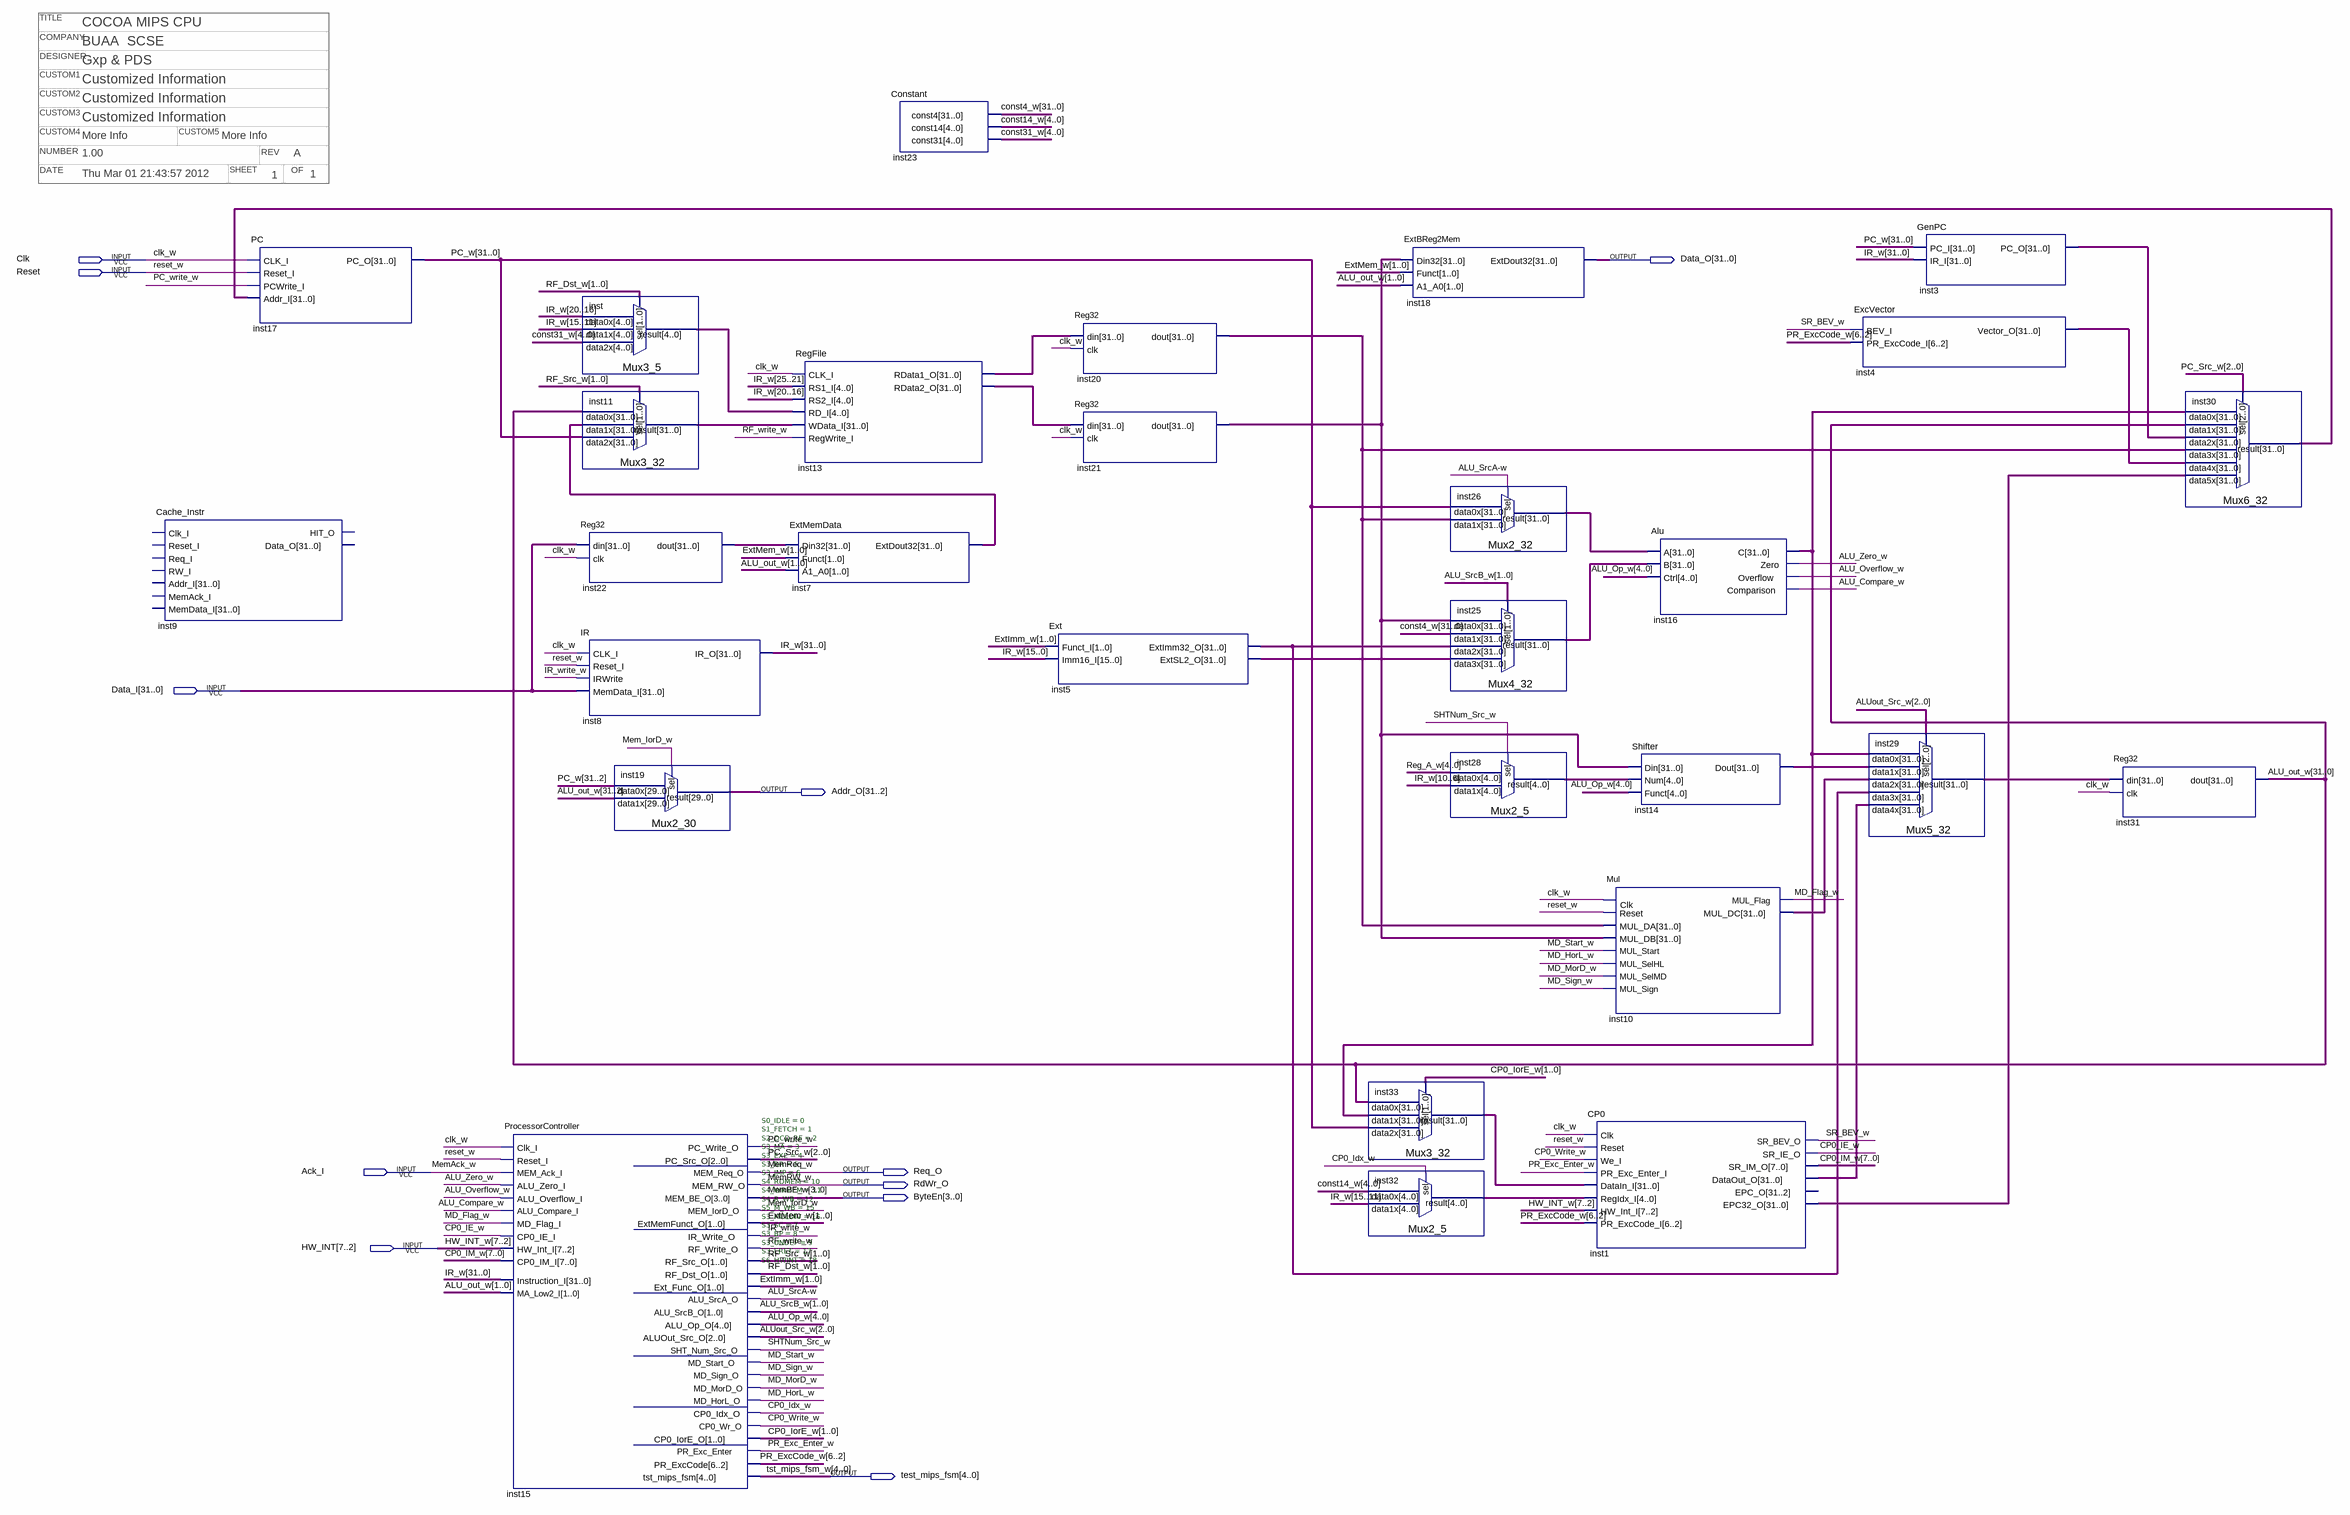
[diagram p0: schematic sheet]
// Quartus schematic MIPS_CPU.bdf as structural Verilog: 29 symbols, 11 pins
// Title block: COMPANY: BUAA  SCSE; CUSTOM1: Customized Information; CUSTOM2: Customized Information; CUSTOM3: Customized Information; CUSTOM4: More Info; CUSTOM5: More Info; DATE: Thu Mar 01 21:43:57 2012; DESIGNER: Gxp & PDS; NUMBER: 1.00; OF: 1; REV: A; SHEET: 1; TITLE: COCOA MIPS CPU
module MIPS_CPU (
  input  Clk,
  input  Reset,
  input  [31:0] Data_I,
  input  Ack_I,
  input  [7:2] HW_INT,
  output [31:0] Data_O,
  output [31:2] Addr_O,
  output Req_O,
  output RdWr_O,
  output [3:0] ByteEn,
  output [4:0] test_mips_fsm
);

  wire ALU_Compare_w, ALU_Overflow_w, \ALU_SrcA-w , ALU_Zero_w, CP0_Idx_w, CP0_IE_w, CP0_Write_w, IR_write_w,
       MD_Flag_w, MD_HorL_w, MD_MorD_w, MD_Sign_w, MD_Start_w, Mem_IorD_w, PC_write_w, PR_Exc_Enter_w,
       RF_write_w, SHTNum_Src_w, SR_BEV_w;
  wire [1:0] ALU_SrcB_w, CP0_IorE_w, ExtImm_w, ExtMem_w, RF_Dst_w, RF_Src_w;
  wire [2:0] ALUout_Src_w, PC_Src_w;
  wire [4:0] ALU_Op_w, const14_w, const31_w, inst28_result, inst32_result, inst_result, Reg_A_w;
  wire [6:2] PR_ExcCode_w;
  wire [7:0] CP0_IM_w;
  wire [31:0] ALU_out_w, const4_w, inst1_dataout_o, inst1_epc32_o, inst3_pc_o, inst4_vector_o,
       inst5_extimm32_o, inst5_extsl2_o, inst7_extdout32, inst10_mul_dc, inst11_result, inst13_rdata1_o,
       inst13_rdata2_o, inst14_dout, inst16_c, inst20_dout, inst21_dout, inst22_dout, inst25_result,
       inst26_result, inst29_result, inst30_result, inst33_result, IR_w, PC_w;

  Cache_Instr inst9 ();  // open: Clk_I, Reset_I, Req_I, RW_I, Addr_I, MemAck_I, MemData_I, HIT_O, Data_O
  PC inst17 (.CLK_I(Clk), .Reset_I(Reset), .Addr_I(inst30_result), .PCWrite_I(PC_write_w), .PC_O(PC_w));
  ProcessorController #(.S0_IDLE(0), .S1_FETCH(1), .S2_DCD_RF(2), .S3_MA(3), .S3_EXE(4), .S3_BR(5), .S3_JMP(6), .S4_RDMEM(10), .S4_WRMEM(11), .S4_R_WB(12), .S5_M_WB(15), .S3_MULDIV(16), .S3_SC(7), .S3_BP(8), .S3_UNDEF(9), .S3_ERET(17), .S6_HWINT(18)) inst15 (
    .MA_Low2_I(ALU_out_w[1:0]), .Instruction_I(IR_w), .MEM_Ack_I(Ack_I), .ALU_Zero_I(ALU_Zero_w),
    .ALU_Overflow_I(ALU_Overflow_w), .ALU_Compare_I(ALU_Compare_w), .MD_Flag_I(MD_Flag_w),
    .CP0_IM_I(CP0_IM_w), .CP0_IE_I(CP0_IE_w), .HW_Int_I(HW_INT), .Clk_I(Clk), .Reset_I(Reset),
    .PC_Write_O(PC_write_w), .PC_Src_O(PC_Src_w), .MEM_Req_O(Req_O), .MEM_RW_O(RdWr_O), .MEM_BE_O(ByteEn),
    .MEM_IorD_O(Mem_IorD_w), .IR_Write_O(IR_write_w), .ExtMemFunct_O(ExtMem_w), .RF_Write_O(RF_write_w),
    .RF_Dst_O(RF_Dst_w), .RF_Src_O(RF_Src_w), .Ext_Func_O(ExtImm_w), .ALU_SrcA_O(\ALU_SrcA-w ),
    .ALU_SrcB_O(ALU_SrcB_w), .ALU_Op_O(ALU_Op_w), .ALUOut_Src_O(ALUout_Src_w), .SHT_Num_Src_O(SHTNum_Src_w),
    .MD_MorD_O(MD_MorD_w), .MD_Sign_O(MD_Sign_w), .MD_Start_O(MD_Start_w), .MD_HorL_O(MD_HorL_w),
    .CP0_IorE_O(CP0_IorE_w), .CP0_Idx_O(CP0_Idx_w), .CP0_Wr_O(CP0_Write_w), .PR_Exc_Enter(PR_Exc_Enter_w),
    .PR_ExcCode(PR_ExcCode_w), .tst_mips_fsm(test_mips_fsm));
  Mux3_5 inst (.data2x(const31_w), .data1x(IR_w[15:11]), .data0x(IR_w[20:16]), .sel(RF_Dst_w), .result(inst_result));
  Mux3_32 inst11 (.data2x(PC_w), .data1x(inst7_extdout32), .data0x(ALU_out_w), .sel(RF_Src_w), .result(inst11_result));
  Reg32 inst22 (.din(Data_I), .clk(Clk), .dout(inst22_dout));
  IR inst8 (.CLK_I(Clk), .Reset_I(Reset), .MemData_I(Data_I), .IRWrite(IR_write_w), .IR_O(IR_w));
  Mux2_30 inst19 (.data1x(ALU_out_w[31:2]), .data0x(PC_w[31:2]), .sel(Mem_IorD_w), .result(Addr_O));
  RegFile inst13 (
    .CLK_I(Clk), .RS1_I(IR_w[25:21]), .RS2_I(IR_w[20:16]), .RD_I(inst_result), .RegWrite_I(RF_write_w),
    .WData_I(inst11_result), .RData1_O(inst13_rdata1_o), .RData2_O(inst13_rdata2_o));
  ExtMemData inst7 (.Din32(inst22_dout), .Funct(ExtMem_w), .A1_A0(ALU_out_w[1:0]), .ExtDout32(inst7_extdout32));
  Constant inst23 (.const4(const4_w), .const14(const14_w), .const31(const31_w));
  Reg32 inst20 (.din(inst13_rdata1_o), .clk(Clk), .dout(inst20_dout));
  Reg32 inst21 (.din(inst13_rdata2_o), .clk(Clk), .dout(inst21_dout));
  Ext inst5 (.Funct_I(ExtImm_w), .Imm16_I(IR_w[15:0]), .ExtImm32_O(inst5_extimm32_o), .ExtSL2_O(inst5_extsl2_o));
  Mux3_32 inst33 (.data2x(PC_w), .data1x(inst16_c), .data0x(ALU_out_w), .sel(CP0_IorE_w), .result(inst33_result));
  Mux2_5 inst32 (.data1x(IR_w[15:11]), .data0x(const14_w), .sel(CP0_Idx_w), .result(inst32_result));
  ExtBReg2Mem inst18 (.Din32(inst21_dout), .Funct(ExtMem_w), .A1_A0(ALU_out_w[1:0]), .ExtDout32(Data_O));
  Mux2_32 inst26 (.data1x(inst20_dout), .data0x(PC_w), .sel(\ALU_SrcA-w ), .result(inst26_result));
  Mux4_32 inst25 (
    .data3x(inst5_extsl2_o), .data2x(inst5_extimm32_o), .data1x(const4_w), .data0x(inst21_dout),
    .sel(ALU_SrcB_w), .result(inst25_result));
  Mux2_5 inst28 (.data1x(IR_w[10:6]), .data0x(Reg_A_w), .sel(SHTNum_Src_w), .result(inst28_result));
  CP0 inst1 (
    .RegIdx_I(inst32_result), .DataIn_I(inst33_result), .We_I(CP0_Write_w), .PR_Exc_Enter_I(PR_Exc_Enter_w),
    .PR_ExcCode_I(PR_ExcCode_w), .HW_Int_I(HW_INT), .Clk(Clk), .Reset(Reset), .DataOut_O(inst1_dataout_o),
    .SR_BEV_O(SR_BEV_w), .SR_IM_O(CP0_IM_w), .SR_IE_O(CP0_IE_w), .EPC32_O(inst1_epc32_o));  // open: EPC_O
  Shifter inst14 (.Din(inst21_dout), .Num(inst28_result), .Funct(ALU_Op_w), .Dout(inst14_dout));
  Mul inst10 (
    .Reset(Reset), .MUL_DA(inst20_dout), .MUL_DB(inst21_dout), .Clk(Clk), .MUL_SelHL(MD_HorL_w),
    .MUL_Start(MD_Start_w), .MUL_SelMD(MD_MorD_w), .MUL_Sign(MD_Sign_w), .MUL_Flag(MD_Flag_w),
    .MUL_DC(inst10_mul_dc));
  Alu inst16 (
    .A(inst26_result), .B(inst25_result), .Ctrl(ALU_Op_w), .C(inst16_c), .Zero(ALU_Zero_w),
    .Overflow(ALU_Overflow_w), .Comparison(ALU_Compare_w));
  ExcVector inst4 (.BEV_I(SR_BEV_w), .PR_ExcCode_I(PR_ExcCode_w), .Vector_O(inst4_vector_o));
  Mux5_32 inst29 (
    .data4x(inst1_dataout_o), .data3x(inst5_extimm32_o), .data2x(inst10_mul_dc), .data1x(inst14_dout),
    .data0x(inst16_c), .sel(ALUout_Src_w), .result(inst29_result));
  GenPC inst3 (.PC_I(PC_w), .IR_I(IR_w), .PC_O(inst3_pc_o));
  Reg32 inst31 (.din(inst29_result), .clk(Clk), .dout(ALU_out_w));
  Mux6_32 inst30 (
    .data5x(inst1_epc32_o), .data4x(inst4_vector_o), .data3x(inst20_dout), .data2x(inst3_pc_o),
    .data1x(ALU_out_w), .data0x(inst16_c), .sel(PC_Src_w), .result(inst30_result));

  // Other names for the same wires on the sheet: clk_w = Clk; HW_INT_w[7:2] = HW_INT; MemAck_w = Ack_I;
  //   MemBE_w[3:0] = ByteEn; MemReq_w = Req_O; MemRW_w = RdWr_O; reset_w = Reset; tst_mips_fsm_w[4:0] = test_mips_fsm
endmodule
